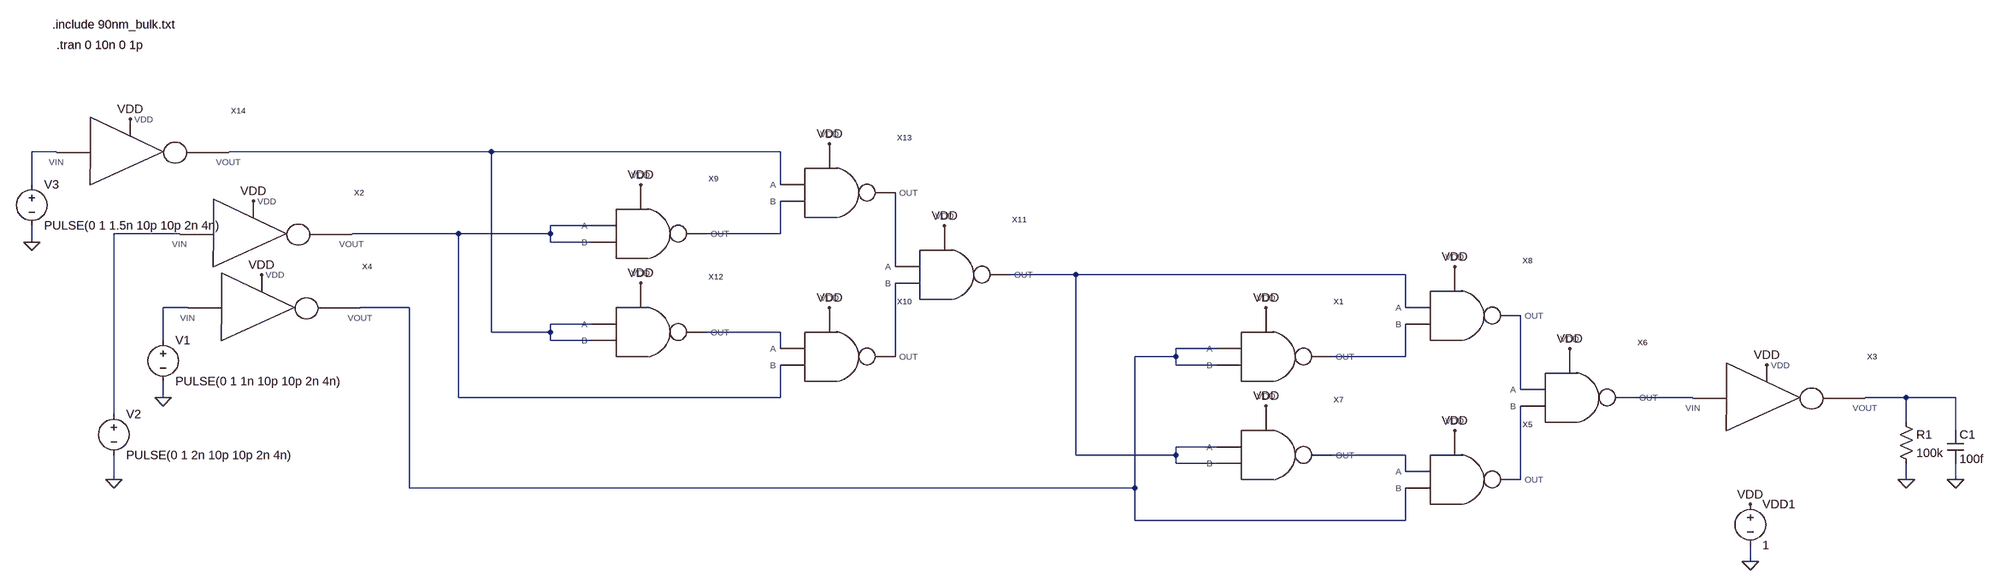
[diagram p0: schematic task_6.asc]
task_6.asc, the LTspice schematic file:
Version 4
SHEET 1 1580 788
WIRE -2240 -576 -2288 -576
WIRE -1392 -576 -1904 -576
WIRE -784 -576 -1392 -576
WIRE -2288 -512 -2288 -576
WIRE -784 -512 -784 -576
WIRE -1152 -432 -1232 -432
WIRE -2000 -416 -2128 -416
WIRE -1456 -416 -1664 -416
WIRE -1232 -416 -1232 -432
WIRE -1232 -416 -1456 -416
WIRE -784 -416 -784 -480
WIRE -784 -416 -928 -416
WIRE -2288 -400 -2288 -432
WIRE -1232 -400 -1232 -416
WIRE -1152 -400 -1232 -400
WIRE -560 -352 -560 -496
WIRE -208 -336 -336 -336
WIRE 448 -336 -208 -336
WIRE -1984 -272 -2032 -272
WIRE -1552 -272 -1648 -272
WIRE 448 -272 448 -336
WIRE -1152 -240 -1232 -240
WIRE -1392 -224 -1392 -576
WIRE -1232 -224 -1232 -240
WIRE -1232 -224 -1392 -224
WIRE -784 -224 -928 -224
WIRE -2032 -208 -2032 -272
WIRE -1232 -208 -1232 -224
WIRE -1152 -208 -1232 -208
WIRE -784 -192 -784 -224
WIRE 80 -192 0 -192
WIRE -560 -176 -560 -320
WIRE 0 -176 0 -192
WIRE 0 -176 -80 -176
WIRE 448 -176 448 -240
WIRE 448 -176 304 -176
WIRE 0 -160 0 -176
WIRE 80 -160 0 -160
WIRE 672 -112 672 -256
WIRE -2032 -96 -2032 -128
WIRE -1456 -96 -1456 -416
WIRE -784 -96 -784 -160
WIRE -784 -96 -1456 -96
WIRE 1008 -96 896 -96
WIRE 1424 -96 1344 -96
WIRE 1520 -96 1424 -96
WIRE -2128 -64 -2128 -416
WIRE 1424 -48 1424 -96
WIRE 1520 -32 1520 -96
WIRE 80 0 0 0
WIRE -208 16 -208 -336
WIRE 0 16 0 0
WIRE 0 16 -208 16
WIRE 448 16 304 16
WIRE 0 32 0 16
WIRE 80 32 0 32
WIRE 448 48 448 16
WIRE -2128 64 -2128 16
WIRE 672 64 672 -80
WIRE 1424 64 1424 32
WIRE 1520 64 1520 32
WIRE -1552 80 -1552 -272
WIRE -80 80 -80 -176
WIRE -80 80 -1552 80
WIRE -80 144 -80 80
WIRE 448 144 448 80
WIRE 448 144 -80 144
WIRE 1120 224 1120 192
FLAG 1120 112 VDD
FLAG 1120 224 0
FLAG -2128 64 0
FLAG -2032 -96 0
FLAG 1424 64 0
FLAG 1520 64 0
FLAG -1856 -480 VDD
FLAG -1840 -336 VDD
FLAG 1152 -160 VDD
FLAG 176 -272 VDD
FLAG 176 -80 VDD
FLAG 544 -32 VDD
FLAG 544 -352 VDD
FLAG 768 -192 VDD
FLAG -1056 -512 VDD
FLAG -1056 -320 VDD
FLAG -688 -272 VDD
FLAG -688 -592 VDD
FLAG -464 -432 VDD
FLAG -2288 -400 0
FLAG -2096 -640 VDD
SYMBOL voltage 1120 96 R0
WINDOW 123 0 0 Left 2
WINDOW 39 0 0 Left 2
SYMATTR InstName VDD1
SYMATTR Value 1
SYMBOL voltage -2128 -80 R0
WINDOW 123 0 0 Left 2
WINDOW 39 0 0 Left 2
SYMATTR InstName V2
SYMATTR Value PULSE(0 1 2n 10p 10p 2n 4n)
SYMBOL voltage -2032 -224 R0
WINDOW 123 0 0 Left 2
WINDOW 39 0 0 Left 2
SYMATTR InstName V1
SYMATTR Value PULSE(0 1 1n 10p 10p 2n 4n)
SYMBOL res 1408 -64 R0
SYMATTR InstName R1
SYMATTR Value 100k
SYMBOL cap 1504 -32 R0
SYMATTR InstName C1
SYMATTR Value 100f
SYMBOL inverter -1872 -416 R0
SYMATTR InstName X2
SYMBOL inverter 1136 -96 R0
SYMATTR InstName X3
SYMBOL inverter -1856 -272 R0
SYMATTR InstName X4
SYMBOL nand 176 -176 R0
SYMATTR InstName X1
SYMBOL nand 544 64 R0
SYMATTR InstName X5
SYMBOL nand 768 -96 R0
SYMATTR InstName X6
SYMBOL nand 176 16 R0
SYMATTR InstName X7
SYMBOL nand 544 -256 R0
SYMATTR InstName X8
SYMBOL nand -1056 -416 R0
SYMATTR InstName X9
SYMBOL nand -688 -176 R0
SYMATTR InstName X10
SYMBOL nand -464 -336 R0
SYMATTR InstName X11
SYMBOL nand -1056 -224 R0
SYMATTR InstName X12
SYMBOL nand -688 -496 R0
SYMATTR InstName X13
SYMBOL voltage -2288 -528 R0
WINDOW 123 0 0 Left 2
WINDOW 39 0 0 Left 2
SYMATTR InstName V3
SYMATTR Value PULSE(0 1 1.5n 10p 10p 2n 4n)
SYMBOL inverter -2112 -576 R0
SYMATTR InstName X14
TEXT -2240 -800 Left 2 !.tran 0 10n 0 1p
TEXT -2248 -840 Left 2 !.include 90nm_bulk.txt

The netlist it stands for:
* task_6.asc
VDD1 VDD 0 1
V2 N004 0 PULSE(0 1 2n 10p 10p 2n 4n)
V1 N008 0 PULSE(0 1 1n 10p 10p 2n 4n)
R1 N015 0 100k
C1 N015 0 100f
XX2 N004 N003 VDD inverter  ; pins VIN VOUT VDD
XX3 N014 N015 VDD inverter  ; pins VIN VOUT VDD
XX4 N008 N009 VDD inverter  ; pins VIN VOUT VDD
XX1 N009 N009 N012 VDD nand  ; pins A B OUT VDD
XX5 N016 N009 N017 VDD nand  ; pins A B OUT VDD
XX6 N013 N017 N014 VDD nand  ; pins A B OUT VDD
XX7 N007 N007 N016 VDD nand  ; pins A B OUT VDD
XX8 N007 N012 N013 VDD nand  ; pins A B OUT VDD
XX9 N003 N003 N005 VDD nand  ; pins A B OUT VDD
XX10 N010 N003 N011 VDD nand  ; pins A B OUT VDD
XX11 N006 N011 N007 VDD nand  ; pins A B OUT VDD
XX12 N002 N002 N010 VDD nand  ; pins A B OUT VDD
XX13 N002 N005 N006 VDD nand  ; pins A B OUT VDD
V3 N001 0 PULSE(0 1 1.5n 10p 10p 2n 4n)
XX14 N001 N002 VDD inverter  ; pins VIN VOUT VDD
.tran 0 10n 0 1p
.include 90nm_bulk.txt
.backanno
.end